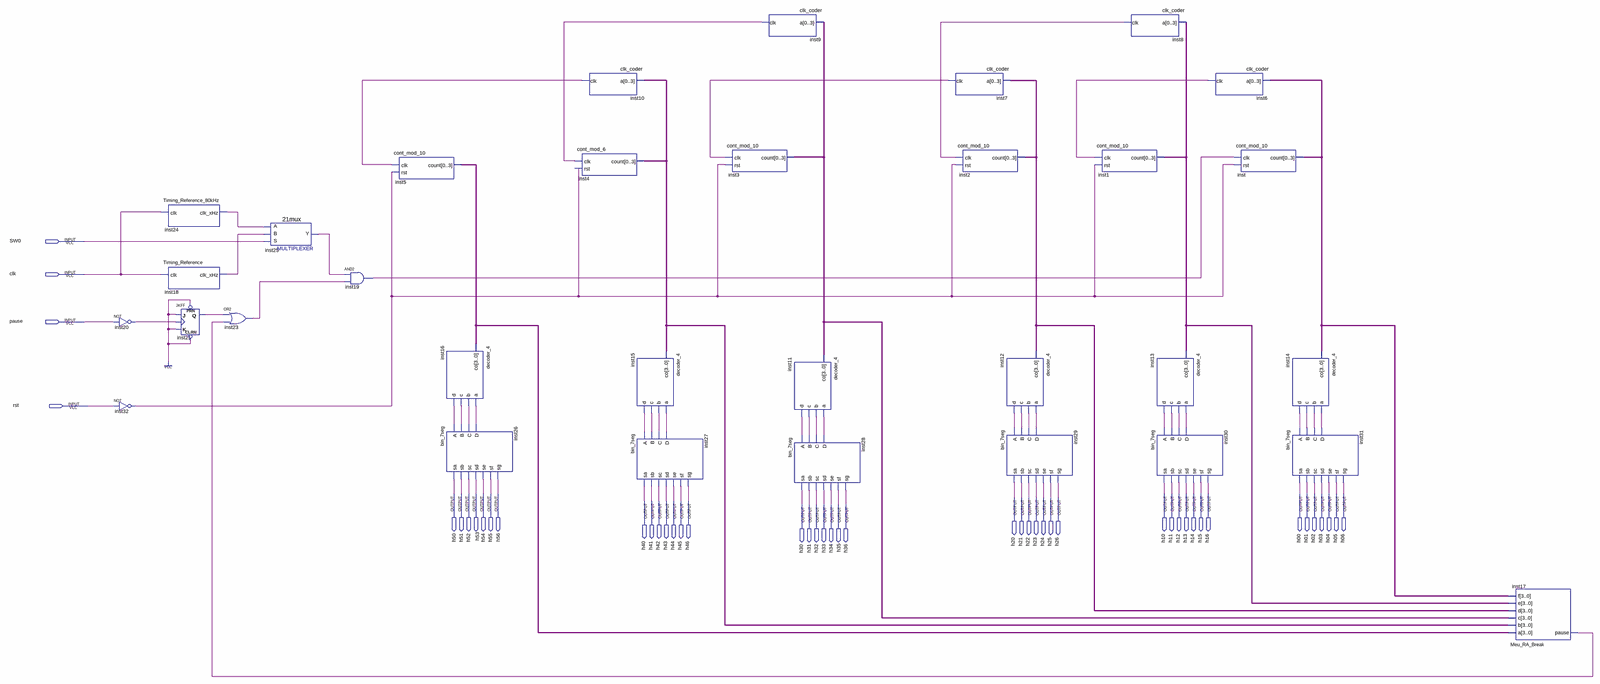
[diagram p0: schematic sheet, whole]
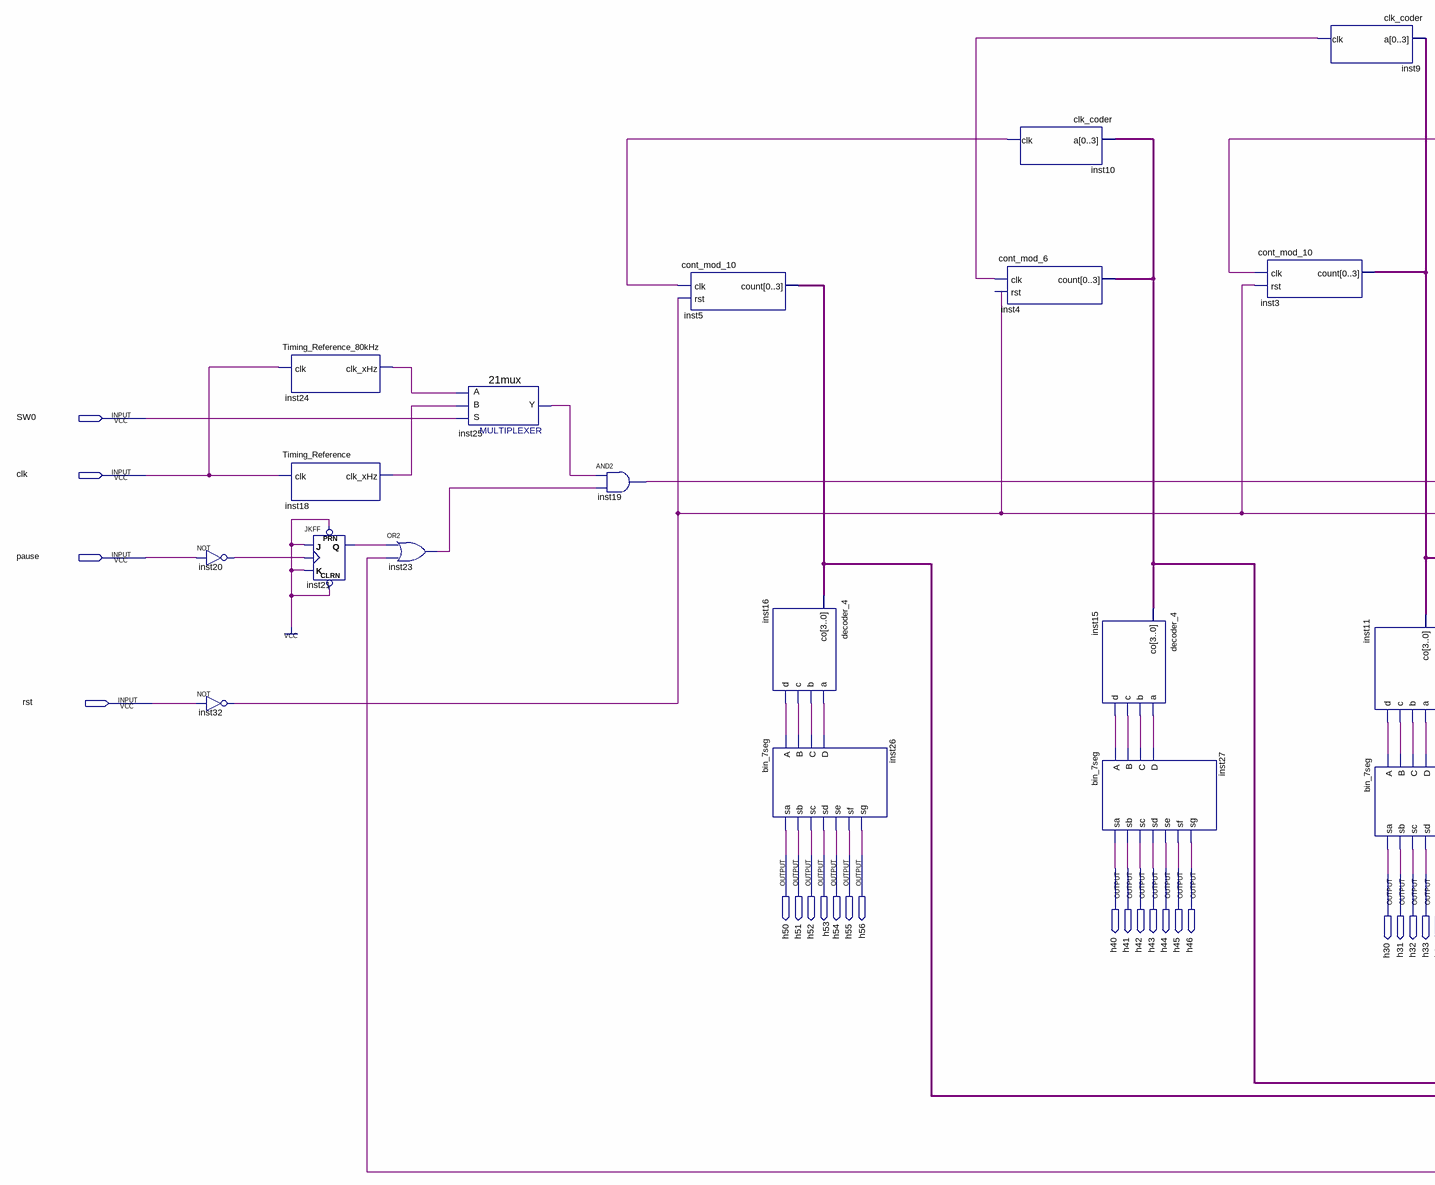
[diagram p1: schematic sheet, left part]
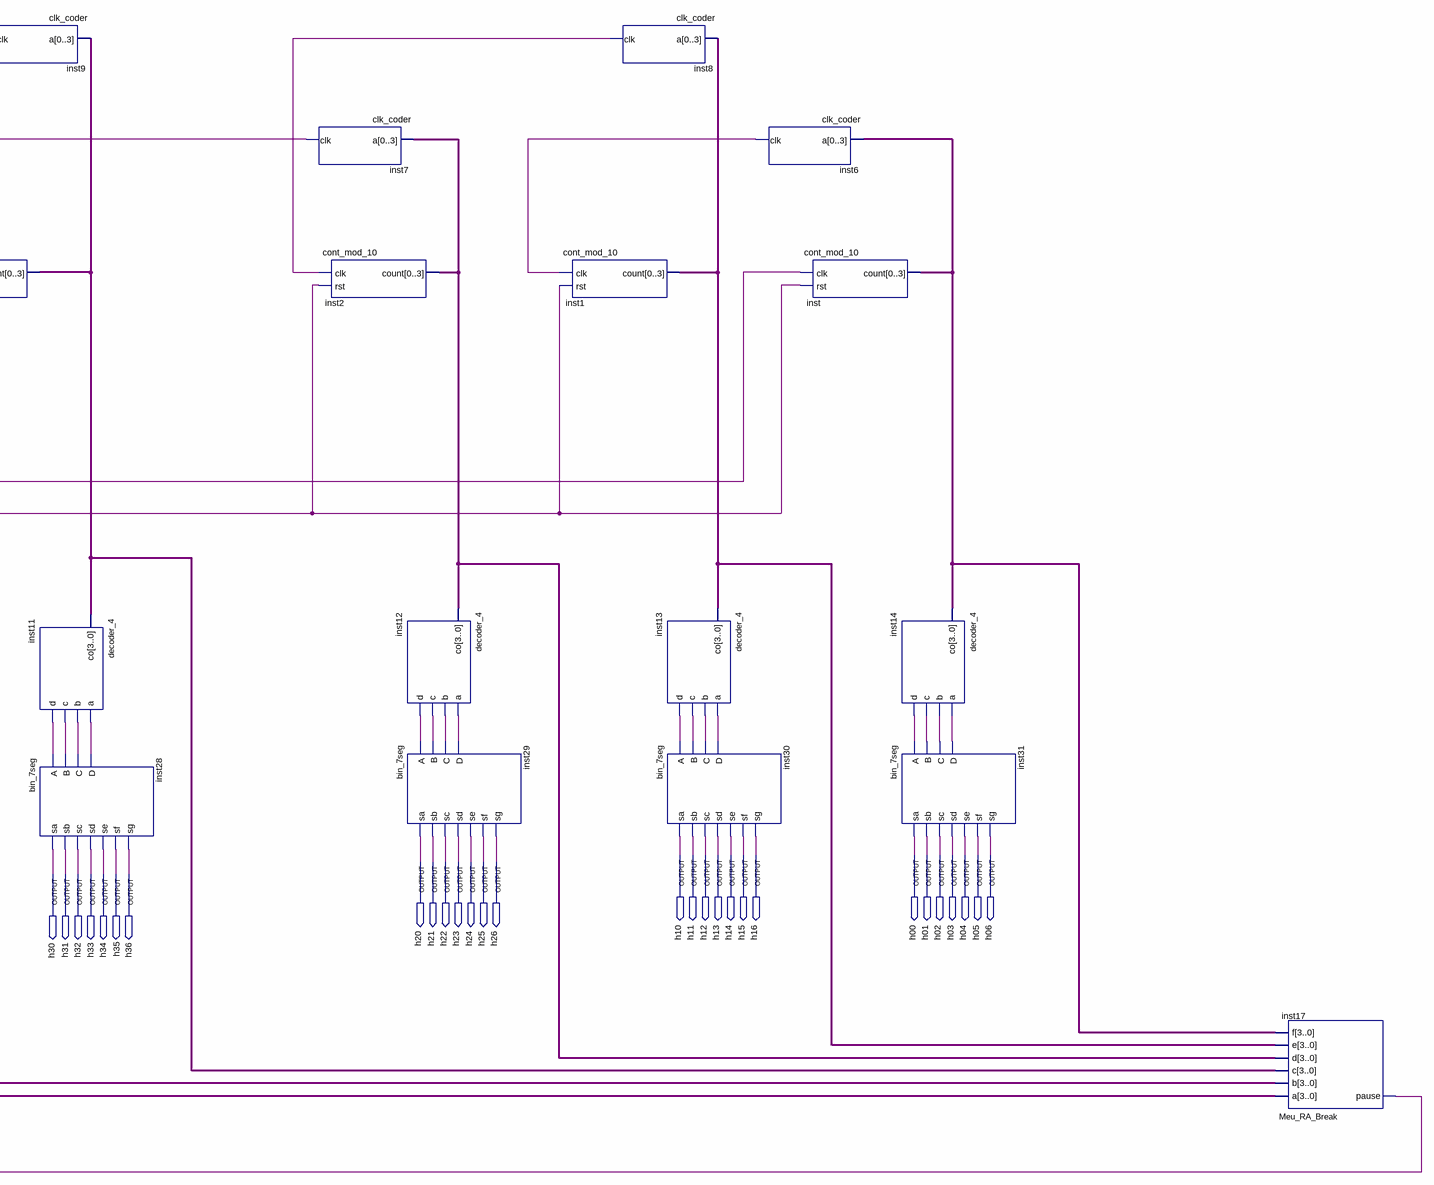
[diagram p2: schematic sheet, right part]
// Quartus schematic lab05.bdf as structural Verilog: 32 symbols, 46 pins
module lab05 (
  input  SW0,
  input  clk,
  input  pause,
  input  rst,
  output h50,
  output h51,
  output h52,
  output h53,
  output h54,
  output h55,
  output h56,
  output h10,
  output h11,
  output h12,
  output h13,
  output h14,
  output h15,
  output h16,
  output h00,
  output h01,
  output h02,
  output h03,
  output h04,
  output h05,
  output h06,
  output h20,
  output h21,
  output h22,
  output h23,
  output h24,
  output h25,
  output h26,
  output h40,
  output h41,
  output h42,
  output h43,
  output h44,
  output h45,
  output h46,
  output h30,
  output h31,
  output h32,
  output h33,
  output h34,
  output h35,
  output h36
);

  wire inst6_clk, inst7_clk, inst8_clk, inst9_clk, inst10_clk, inst11_a, inst11_b, inst11_c, inst11_d,
       inst12_a, inst12_b, inst12_c, inst12_d, inst13_a, inst13_b, inst13_c, inst13_d, inst14_a, inst14_b,
       inst14_c, inst14_d, inst15_a, inst15_b, inst15_c, inst15_d, inst16_a, inst16_b, inst16_c, inst16_d,
       inst17_pause, inst18_clk_xhz, inst19_out, inst20_out, inst21_q, inst23_out, inst24_clk_xhz, inst25_y,
       inst32_out;
  wire [3:0] inst1_count, inst2_count, inst3_count, inst4_count, inst5_count, inst_count;

  not inst20 (inst20_out, pause);
  not inst32 (inst32_out, rst);
  Timing_Reference_80kHz inst24 (.clk(clk), .clk_xHz(inst24_clk_xhz));
  Timing_Reference inst18 (.clk(clk), .clk_xHz(inst18_clk_xhz));
  JKFF inst21 (.PRN(1'b1), .CLRN(1'b1), .K(1'b1), .J(1'b1), .CLK(inst20_out), .Q(inst21_q));
  or inst23 (inst23_out, inst21_q, inst17_pause);
  \21mux  inst25 (.S(SW0), .B(inst18_clk_xhz), .A(inst24_clk_xhz), .Y(inst25_y));
  and inst19 (inst19_out, inst25_y, inst23_out);
  cont_mod_10 inst5 (.clk(inst10_clk), .rst(inst32_out), .count(inst5_count));
  decoder_4 inst16 (.co(inst5_count), .a(inst16_a), .b(inst16_b), .c(inst16_c), .d(inst16_d));
  bin_7seg inst26 (
    .A(inst16_d), .B(inst16_c), .C(inst16_b), .D(inst16_a), .sa(h50), .sb(h51), .sc(h52), .sd(h53), .se(h54),
    .sf(h55), .sg(h56));
  clk_coder inst10 (.a(inst4_count), .clk(inst10_clk));
  cont_mod_6 inst4 (.clk(inst9_clk), .rst(inst32_out), .count(inst4_count));
  decoder_4 inst15 (.co(inst4_count), .a(inst15_a), .b(inst15_b), .c(inst15_c), .d(inst15_d));
  bin_7seg inst27 (
    .A(inst15_d), .B(inst15_c), .C(inst15_b), .D(inst15_a), .sa(h40), .sb(h41), .sc(h42), .sd(h43), .se(h44),
    .sf(h45), .sg(h46));
  cont_mod_10 inst3 (.clk(inst7_clk), .rst(inst32_out), .count(inst3_count));
  clk_coder inst9 (.a(inst3_count), .clk(inst9_clk));
  decoder_4 inst11 (.co(inst3_count), .a(inst11_a), .b(inst11_b), .c(inst11_c), .d(inst11_d));
  bin_7seg inst28 (
    .A(inst11_d), .B(inst11_c), .C(inst11_b), .D(inst11_a), .sa(h30), .sb(h31), .sc(h32), .sd(h33), .se(h34),
    .sf(h35), .sg(h36));
  clk_coder inst7 (.a(inst2_count), .clk(inst7_clk));
  cont_mod_10 inst2 (.clk(inst8_clk), .rst(inst32_out), .count(inst2_count));
  decoder_4 inst12 (.co(inst2_count), .a(inst12_a), .b(inst12_b), .c(inst12_c), .d(inst12_d));
  bin_7seg inst29 (
    .A(inst12_d), .B(inst12_c), .C(inst12_b), .D(inst12_a), .sa(h20), .sb(h21), .sc(h22), .sd(h23), .se(h24),
    .sf(h25), .sg(h26));
  cont_mod_10 inst1 (.clk(inst6_clk), .rst(inst32_out), .count(inst1_count));
  clk_coder inst8 (.a(inst1_count), .clk(inst8_clk));
  decoder_4 inst13 (.co(inst1_count), .a(inst13_a), .b(inst13_b), .c(inst13_c), .d(inst13_d));
  bin_7seg inst30 (
    .A(inst13_d), .B(inst13_c), .C(inst13_b), .D(inst13_a), .sa(h10), .sb(h11), .sc(h12), .sd(h13), .se(h14),
    .sf(h15), .sg(h16));
  clk_coder inst6 (.a(inst_count), .clk(inst6_clk));
  cont_mod_10 inst (.clk(inst19_out), .rst(inst32_out), .count(inst_count));
  decoder_4 inst14 (.co(inst_count), .a(inst14_a), .b(inst14_b), .c(inst14_c), .d(inst14_d));
  bin_7seg inst31 (
    .A(inst14_d), .B(inst14_c), .C(inst14_b), .D(inst14_a), .sa(h00), .sb(h01), .sc(h02), .sd(h03), .se(h04),
    .sf(h05), .sg(h06));
  Meu_RA_Break inst17 (
    .a(inst5_count), .b(inst4_count), .c(inst3_count), .d(inst2_count), .e(inst1_count), .f(inst_count),
    .pause(inst17_pause));
endmodule
